# EAGLE design ArduinoBT (EAGLE 7.1.0)
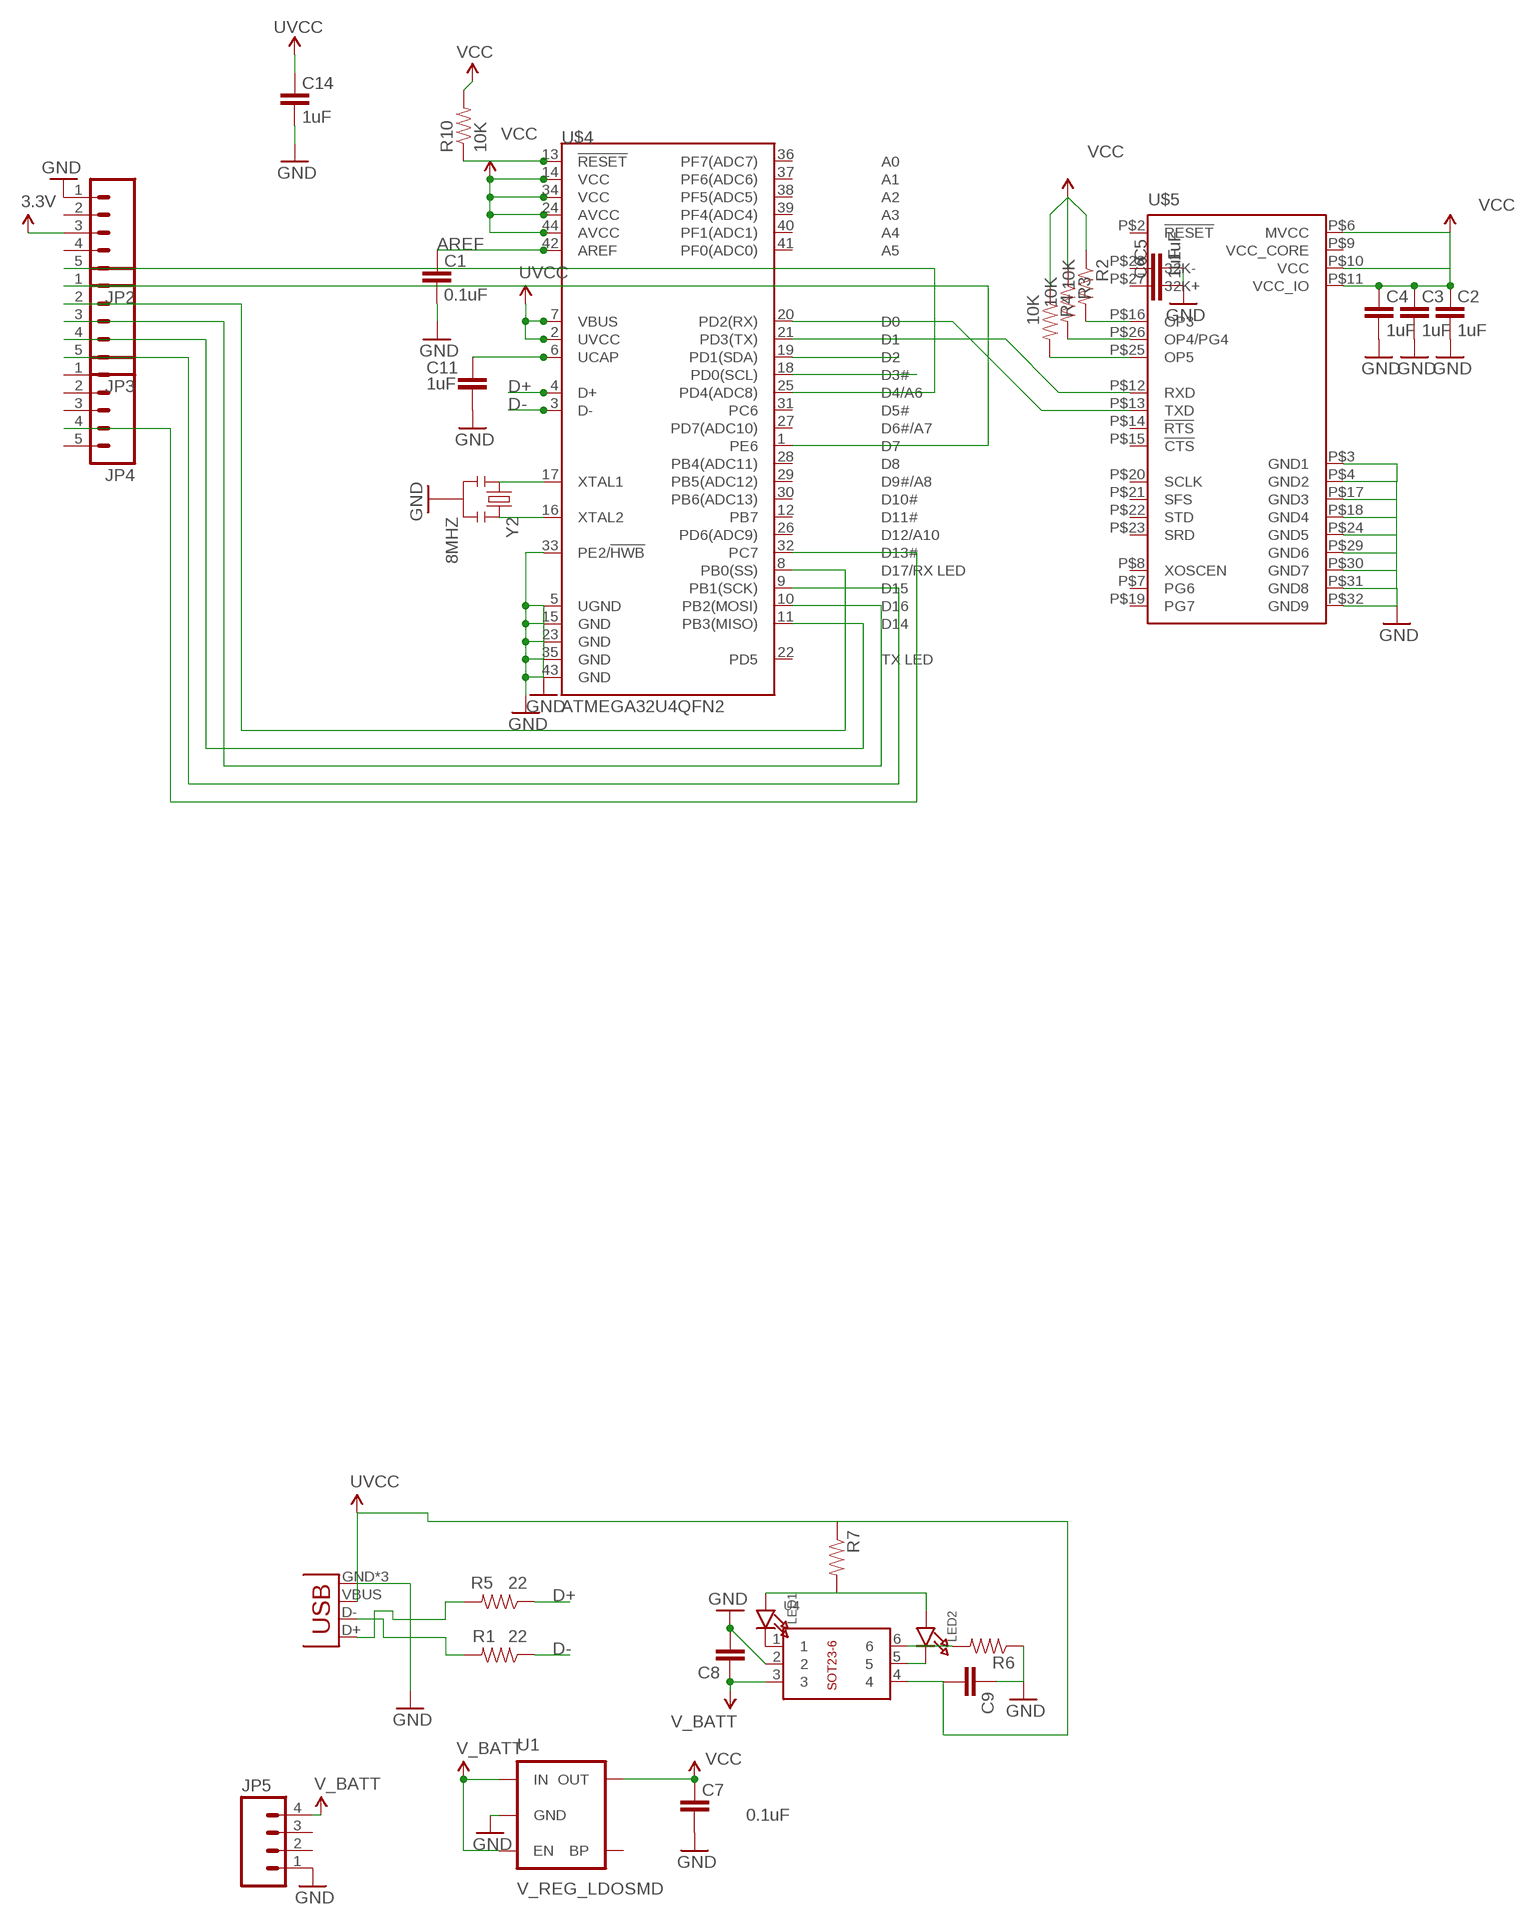
[diagram p0: schematic, sheet 1]

## Parts
C1  0.1uF  CAP0603-CAP  [0603-CAP]
C2  1uF  CAP0603-CAP  [0603-CAP]
C3  1uF  CAP0603-CAP  [0603-CAP]
C4  1uF  CAP0603-CAP  [0603-CAP]
C5  1uF  CAP0603-CAP  [0603-CAP]
C6  1uF  CAP0603-CAP  [0603-CAP]
C7  0.1uF  CAP0603-CAP  [0603-CAP]
C8  CAP0805  [0805]
C9  CAP0805  [0805]
C11  1uF  CAP0603-CAP  [0603-CAP]
C14  1uF  CAP0603-CAP  [0603-CAP]
JP1  USB-MICROB  [USB-MICROB]
JP2  M051.27MM  [1X05-1.27MM]
JP3  M051.27MM  [1X05-1.27MM]
JP4  M051.27MM  [1X05-1.27MM]
JP5  M041.27MM  [1X04-1.27MM]
LED1  LED0603_NOOUTLINE  [CHIPLED_0603_NOOUTLINE]
LED2  LED0603_NOOUTLINE  [CHIPLED_0603_NOOUTLINE]
R1  22  RESISTOR0603-RES  [0603-RES]
R2  10K  RESISTOR0603-RES  [0603-RES]
R3  10K  RESISTOR0603-RES  [0603-RES]
R4  10K  RESISTOR0603-RES  [0603-RES]
R5  22  RESISTOR0603-RES  [0603-RES]
R6  RESISTOR0805-RES  [0805]
R7  RESISTOR0805-RES  [0805]
R10  10K  RESISTOR0603-RES  [0603-RES]
U1  V_REG_LDOSMD  [SOT23-5]
U4  BREAKOUT_SOT23-6  [BREAKOUT_SOT23-6]
U$4  ATMEGA32U4QFN2  [SPARKFUN-DIGITALIC_QFN-44-NOPAD]
U$5  LMX9838  [LTCC70]
Y2  8MHZ  RESONATOR8MHZ  [RESONATOR-SMD]

## Nets
3.3V: C2.2 C3.2 C4.2 C7.2 JP2.3 R2.1 R3.1 R4.1 R10.2 U1.5(OUT) U$4.14(VCC) U$4.24(AVCC) U$4.34(VCC) U$4.44(AVCC) U$5.P$6(MVCC) U$5.P$10(VCC) U$5.P$11(VCC_IO) ; supply symbol labelled VCC
AREF: C1.2 U$4.42(AREF)
D+: R5.1 U$4.4(D+)
D-: R1.1 U$4.3(D-)
GND: C1.1 C2.1 C3.1 C4.1 C5.1 C6.1 C7.1 C8.2 C9.1 C11.1 C14.1 JP1.GND JP1.MT1(GND) JP1.MT2(GND) JP2.1 JP5.1 R6.1 U1.2(GND) U4.2 U$4.5(UGND) U$4.15(GND) U$4.23(GND) U$4.33(PE2/!HWB) U$4.35(GND) U$4.43(GND) U$5.P$3(GND1) U$5.P$4(GND2) U$5.P$17(GND3) U$5.P$18(GND4) U$5.P$24(GND5) U$5.P$29(GND6) U$5.P$30(GND7) U$5.P$31(GND8) U$5.P$32(GND9) Y2.2
N$1: R2.2 U$5.P$16(OP3)
N$2: R3.2 U$5.P$26(OP4/PG4)
N$3: C11.2 U$4.6(UCAP)
N$4: R4.2 U$5.P$25(OP5)
N$5: C5.2 U$5.P$28(32K-)
N$6: JP1.D- R1.2
N$7: JP1.D+ R5.2
N$8: C6.2 U$5.P$27(32K+)
N$9: U$4.16(XTAL2) Y2.3
N$10: R6.2 U4.6
N$11: JP2.5 U$4.25(PD4(ADC8))
N$12: JP3.1 U$4.1(PE6)
N$13: JP3.2 U$4.8(PB0(SS))
N$14: JP3.3 U$4.10(PB2(MOSI))
N$15: JP3.4 U$4.11(PB3(MISO))
N$16: JP3.5 U$4.9(PB1(SCK))
N$17: U$4.17(XTAL1) Y2.1
N$18: LED1.A LED2.A R7.2
N$20: JP4.4 U$4.32(PC7)
N$21: U$4.18(PD0(SCL))
N$25: R10.1 U$4.13(!RESET)
N$27: U$4.19(PD1(SDA))
N$28: U$4.20(PD2(RX)) U$5.P$13(TXD)
N$31: U$4.21(PD3(TX)) U$5.P$12(RXD)
N$32: LED1.C U4.1
N$33: LED2.C U4.5
UVCC: C9.2 C14.2 JP1.VBUS R7.1 U4.4 U$4.2(UVCC) U$4.7(VBUS)
V_BATT: C8.1 JP5.4 U1.1(IN) U1.3(EN) U4.3
Unconnected: JP2.2 JP2.4 JP4.1 JP4.2 JP4.3 JP4.5 JP5.2 JP5.3 U1.4(BP) U$4.12(PB7) U$4.22(PD5) U$4.26(PD6(ADC9)) U$4.27(PD7(ADC10)) U$4.28(PB4(ADC11)) U$4.29(PB5(ADC12)) U$4.30(PB6(ADC13)) U$4.31(PC6) U$4.36(PF7(ADC7)) U$4.37(PF6(ADC6)) U$4.38(PF5(ADC5)) U$4.39(PF4(ADC4)) U$4.40(PF1(ADC1)) U$4.41(PF0(ADC0)) U$5.P$2(!RESET) U$5.P$7(PG6) U$5.P$8(XOSCEN) U$5.P$14(!RTS) U$5.P$15(!CTS) U$5.P$19(PG7) U$5.P$20(SCLK) U$5.P$21(SFS) U$5.P$22(STD) U$5.P$23(SRD)

## Power pins joined to a net without a drawn wire
VCC_CORE: U$5.P$9(VCC_CORE)

## Library data of the parts
C1-C7 C11 C14 = SparkFun:CAP: Capacitor Standard 0603 ceramic capacitor, and 0.1" leaded capacitor.
C8 C9 = SparkFun-Capacitors:CAP: Capacitor Standard 0603 ceramic capacitor, and 0.1" leaded capacitor.
JP1 = SparkFun-Connectors:USB: USB Connectors USB-B-PTH is fully proven SKU : PRT-00139/CONN-08278 USB-miniB is fully proven SKU : PRT-00587 USB-A-PCB is untested. USB-A-H is throughly reviewed, but untested. Spark Fun Electronics SKU : PRT-00437 USB-B-SMT is throughly reviewed, but untested. Needs silkscreen touching up. USB-A-S has not been used/tested USB-MB-H has not been used/tested USB-MICROB has been used. CONN-09505; PROD_ID: CONN-09505
JP2-JP4 = SparkFun-Connectors:M05: Header 5 Standard 5-pin 0.1" header. Use with straight break away headers (SKU : PRT-00116), right angle break away headers (PRT-00553), swiss pins (PRT-00743), machine pins (PRT-00117), and female headers (PRT-00115). Molex polarized connector foot print use with SKU : PRT-08230 with associated crimp pins and housings.
JP5 = SparkFun-Connectors:M04: Header 4 Standard 4-pin 0.1" header. Use with straight break away headers (SKU : PRT-00116), right angle break away headers (PRT-00553), swiss pins (PRT-00743), machine pins (PRT-00117), and female headers (PRT-00115). Molex polarized connector foot print use with SKU : PRT-08231 with associated crimp pins and housings. 1MM SMD Version SKU: PRT-10208
LED1 LED2 = microbuilder:LED: LED 0603 - 0603 Surface Mount Package 2mA: Green LED - Low Power (3.9mcd, 2ma, 1.7Vf) - Digikey: 475-2709-2-ND Orange LED - Low Power (9.8mcd, 2ma, 1.8Vf) - Digikey: 475-1194-2-ND Red LED - Low Power (5mcd, 2ma, 1.8Vf) - Digikey: 475-1195-2-ND Yellow LED - Low Power (7mcd, 2ma, 1.8Vf) - Digikey: 475-1196-2-ND 5mA: Blue LED - Low Power (17mcd, 5ma, 2.9Vf) - Digikey: LNJ937W8CRACT-ND 0805 - 0805 Surface Mount Package 2mA: Red LED (8.8mcd, 2mA, 1.8Vf, Clear) - Low Power [Digikey: 475-2510-1-ND] Green LED (5mcd, 2mA, 1.8Vf, Clear) - Low Power [Digikey: 475-2730-1-ND] Yellow LED (11.3mcd, 2mA, 1.8Vf, Clear) - Low Power [Digikey: 475-2555-1-ND] 20mA: Red LED (104mcd, 20mA, Diffused) - LS R976 [Digikey: 475-1278-6-ND] Red LED (12mcd, 20mA, 2.0Vf, Clear) - APT2012EC [Digikey: 754-1128-1-ND] Green LED (15mcd, 20mA, 2.2Vf, Clear) - APT2012GC [Digikey: 754-1131-1-ND] Orange LED (160mcd, 20mA, 2.1Vf, Clear) - APT2012SECK [Digikey: 754-1130-1-ND] 1206 - 1206 Surface Mount Package Green LED (26mcd, 20mA, Diffused) - LG N971 [Digikey: 475-1407-6-ND] Red LED (15mcd, 20mA, Diffused) - LH N974 [Digikey: 475-1416-6-ND]
R1-R5 R10 = SparkFun:RESISTOR: Resistor Basic schematic elements and footprints for 0603, 1206, and PTH resistors.
R6 R7 = SparkFun-Resistors:RESISTOR: Resistor Basic schematic elements and footprints for 0603, 1206, and PTH resistors.
U1 = SparkFun-PowerIC:V_REG_LDO: Voltage Regulator LDO Standard 150mA LDO voltage regulator in SOT-23 layout. Micrel part MIC5205. BP (by-pass) pin is used to lower output noise with 470pF cap.
U4 = microbuilder:BREAKOUT_SOT23-6: IC Breakout SOT23-6
U$4 = SparkFun-DigitalIC:ATMEGA32U4: Atmel 44-pin 8-bit Microcontroller with 32KBytes of ISP Flash and USB Controller ----- Please use the QFN-44-NOPAD_1:1 package for the footprint of all boards using a 32U4. Route traces directly away from the pads as much as possible.
U$5 = ns_lmx9838:LMX9838: Bluetooth Serial Port Module Manufacturer: National Semiconductor Source: http://www.national.com/mpf/LM/LMX9838.html
Y2 = SparkFun-FreqCtrl:RESONATOR: Resonator Small SMD resonator. Used, eg, on the Arduino Pro/ Pro Mini boards. 8MHz- XTAL-08895 16MHz- XTAL-08900; PROD_ID: XTAL-08895

## Net classes
0 default: width 0.178 mm

## Board
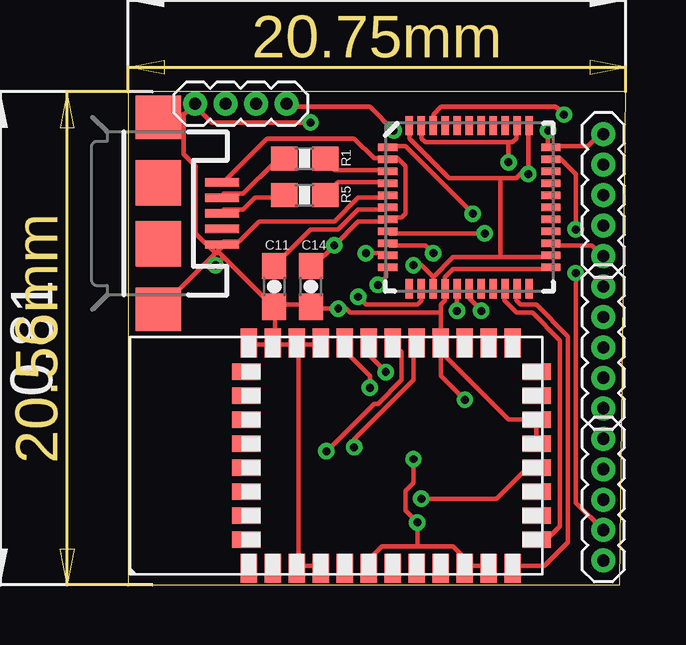
[diagram p1: board, top side]
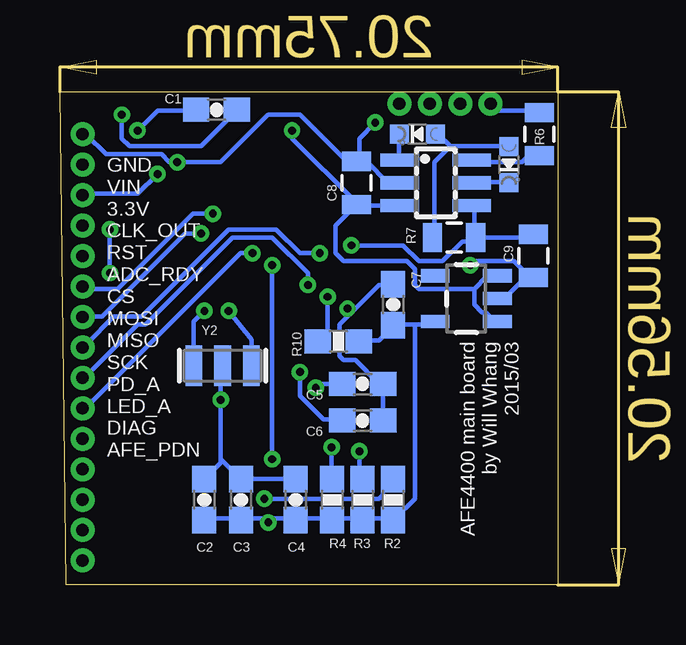
[diagram p2: board, bottom side, seen from below]

Size 20.75 x 20.56 mm. Coordinates in mm from the lower left corner, seen from the top.
Outline: 0,0 20.5,0 20.75,20.56 0,20.56 0,0
Copper layers (1*16): Top 0.0356mm / dielectric 1.5011mm / Bottom 0.0356mm
Design rules "LaenPCBOrder *": minimum track width 6mil, minimum drill 13mil, track to track 6mil, track to pad 6mil, pad to pad 6mil, via to via 6mil, smd to smd 6mil, copper to edge 15mil, drill to drill 6mil, minimum pad ring 7mil, minimum via ring 7mil, stop-mask expansion 3mil, vias tented up to drill 14mil, thermal gap 10mil

### Footprints (pad centres in the part's own frame; a part is rotated, then mirrored left to right if it is on the bottom)
0603-CAP = smd 1.1 x 1: 1 -0.85,0; 2 0.85,0
0805 = smd 0.8 x 1.2: 1 -0.9,0; 2 0.9,0
USB-MICROB = smd 0.35 x 1.4: D+ 0,2.65; D- -0.65,2.65; GND 1.3,2.65; ID 0.65,2.65; VBUS -1.3,2.65 | smd 1.8 x 1.9: MT1 -4,0; MT2 4,0 | smd 1.9 x 1.9: P$1 -1.27,0; P$2 1.27,0
1X05-1.27MM = drill 0.508 pad 1: 1 0,0; 2 1.27,0; 3 2.54,0; 4 3.81,0; 5 5.08,0
1X04-1.27MM = drill 0.508 pad 1: 1 0,0; 2 1.27,0; 3 2.54,0; 4 3.81,0
CHIPLED_0603_NOOUTLINE = smd 0.8 x 0.8: A 0,-0.75; C 0,0.75
0603-RES = smd 1.1 x 1: 1 -0.85,0; 2 0.85,0
SOT23-5 = smd 0.55 x 1.2: 1 -0.95,-1.3; 2 0,-1.3; 3 0.95,-1.3; 4 0.95,1.3; 5 -0.95,1.3
BREAKOUT_SOT23-6 = smd 0.55 x 1.6: 1 -0.95,-1.5; 2 0,-1.5; 3 0.95,-1.5; 4 0.95,1.5; 5 0,1.5; 6 -0.95,1.5
SPARKFUN-DIGITALIC_QFN-44-NOPAD = smd 0.8 x 0.3: 1 -3.4,2.5; 2 -3.4,2; 3 -3.4,1.5; 4 -3.4,1; 5 -3.4,0.5; 6 -3.4,0; 7 -3.4,-0.5; 8 -3.4,-1; 9 -3.4,-1.5; 10 -3.4,-2; 11 -3.4,-2.5; 23 3.4,-2.5; 24 3.4,-2; 25 3.4,-1.5; 26 3.4,-1; 27 3.4,-0.5; 28 3.4,0; 29 3.4,0.5; 30 3.4,1; 31 3.4,1.5; 32 3.4,2; 33 3.4,2.5 | smd 0.3 x 0.8: 12 -2.5,-3.4; 13 -2,-3.4; 14 -1.5,-3.4; 15 -1,-3.4; 16 -0.5,-3.4; 17 0,-3.4; 18 0.5,-3.4; 19 1,-3.4; 20 1.5,-3.4; 21 2,-3.4; 22 2.5,-3.4; 34 2.5,3.4; 35 2,3.4; 36 1.5,3.4; 37 1,3.4; 38 0.5,3.4; 39 0,3.4; 40 -0.5,3.4; 41 -1,3.4; 42 -1.5,3.4; 43 -2,3.4; 44 -2.5,3.4
LTCC70 = smd 1.2 x 0.7: P$1 -8.2,13; P$2 -8.2,12; P$3 -8.2,11; P$4 -8.2,10; P$5 -8.2,9; P$6 -8.2,8; P$7 -8.2,7; P$8 -8.2,6; P$9 -8.2,5; P$10 -8.2,4; P$11 -8.2,3; P$12 -8.2,2; P$21 1.2,2; P$22 1.2,3; P$23 1.2,4; P$24 1.2,5; P$25 1.2,6; P$26 1.2,7; P$27 1.2,8; P$28 1.2,9; P$29 1.2,10; P$30 1.2,11; P$31 1.2,12; P$32 1.2,13 | smd 0.7 x 1.2: P$13 -7,1; P$14 -6,1; P$15 -5,1; P$16 -4,1; P$17 -3,1; P$18 -2,1; P$19 -1,1; P$20 0,1; P$33 0,13.1; P$34 -1,13.1; P$35 -2,13.1; P$36 -3,13.1; P$37 -4,13.1; P$38 -5,13.1; P$39 -6,13.1; P$40 -7,13.1
RESONATOR-SMD = smd 0.7 x 1.7: 1 -1.2,0; 2 0,0; 3 1.2,0

### Placement (x,y rotation side)
C1  14.22,19.81 0 bottom
C2  14.73,3.56 270 bottom
C3  13.21,3.56 270 bottom
C4  10.92,3.56 270 bottom
C5  8.13,8.38 180 bottom
C6  8.13,6.86 180 bottom
C7  6.86,11.68 270 bottom
C8  8.38,16.76 90 bottom
C9  1.02,13.72 90 bottom
C11  6.1,12.45 90 top
C14  7.62,12.45 90 top
JP1  1.27,15.49 270 top
JP2  19.81,18.8 270 top
JP3  19.81,12.45 270 top
JP4  19.81,6.1 270 top
JP5  2.79,20.07 0 top
LED1  5.84,18.8 90 bottom
LED2  2.03,17.53 180 bottom
R1  7.37,17.78 180 top
R2  6.86,3.56 90 bottom
R3  8.13,3.56 90 bottom
R4  9.4,3.56 90 bottom
R5  7.37,16.26 180 top
R6  0.76,18.8 270 bottom
R7  4.32,14.48 180 bottom
R10  9.14,10.16 0 bottom
U1  3.81,11.94 90 bottom
U4  5.08,16.76 270 bottom
U$4  14.22,15.75 0 top
U$5  18.03,8.89 90 top
Y2  13.97,9.14 0 bottom

### Tracks (layer width: path | path; a pad name or v marks a point on that pad's centre or on a via)
3.3V  (via drill 0.33)
  Top 0.178: 12.73,12.84 12.73,12.51 U$4.14 | 12.73,12.84 13.55,13.66 15.53,13.66 | 15.53,13.66 17.51,13.66 U$4.24 | 15.53,16.97 16.19,16.97 16.52,17.3 | 15.53,16.97 13.39,16.97 11.73,18.62 11.73,19.11 U$4.44 | 16.52,17.3 16.69,17.46 16.69,19.11 U$4.34 | 16.52,17.3 v16.69,17.13 | 15.53,16.97 15.53,13.66 | 12.06,1.61 13.55,1.61 13.88,1.28 13.88,0.79 U$5.P$10 14.05,0.79 14.87,0.79 U$5.P$11 | 12.06,1.61 10.58,1.61 10.08,1.12 10.08,0.79 U$5.P$6 | 12.06,1.61 v12.06,2.6 11.57,3.1 11.57,3.92 11.9,4.25 v11.9,5.25 | 12.73,12.84 12.23,13.34 v11.9,13.34
  Bottom 0.178: v16.69,17.13 17.51,16.31 19.66,16.31 JP2.3 | 5.96,10.86 5.13,10.86 U1.5 | 5.96,10.86 6.78,10.86 C7.2 6.95,10.69 7.44,10.2 8.27,10.2 R10.2 | C2.2 14.71,2.77 13.22,2.77 C3.2 13.06,2.77 12.06,2.77 | 12.06,2.77 11.07,2.77 C4.2 10.91,2.77 9.42,2.77 R4.1 9.26,2.77 8.27,2.77 R3.1 8.1,2.77 6.95,2.77 R2.1 6.78,2.77 5.96,3.59 5.96,10.86 | 12.06,2.77 v12.06,2.6 | v11.9,5.25 v11.9,13.34
AREF  (via drill 0.33)
  Top 0.178: v18.17,19.61 17.84,19.94 13.06,19.94 12.73,19.61 12.73,19.28 U$4.42
  Bottom 0.178: v18.17,19.61 18.17,18.62 17.84,18.29 14.87,18.29 13.39,19.77 C1.2
D+
  Top 0.178: U$4.4 10.74,16.8 8.76,16.8 8.27,16.31 R5.1
D-
  Top 0.178: U$4.3 10.74,17.3 8.6,17.3 8.27,17.63 R1.1
GND  (via drill 0.33)
  Top 0.178: U$5.P$17 17.02,5.91 17.02,6.73 U$5.P$18 17.02,6.9 15.86,6.9 13.06,9.7 | U$4.23 17.51,13.17 13.55,13.17 13.22,12.84 13.22,12.51 U$4.15 13.22,11.85 13.06,11.68 13.06,11.35 | C11.1 6.12,11.52 6.12,10.2 U$5.P$31 | C11.1 6.12,11.68 7.61,11.68 C14.1 7.77,11.52 v8.76,11.52 9.09,11.52 9.26,11.35 13.06,11.35 | U$5.P$32 5.13,10.03 5.96,10.03 U$5.P$31 | U$5.P$31 6.12,10.03 6.95,10.03 U$5.P$30 7.11,10.03 | 15.86,18.45 16.03,18.45 16.19,18.62 16.19,19.11 U$4.35 | 15.86,18.45 12.39,18.45 12.23,18.62 12.23,19.11 U$4.43 | JP2.1 19.66,18.78 19.16,18.29 17.68,18.29 U$4.33 17.51,18.29 v17.51,18.95 | v15.86,17.63 15.86,18.45 | 2.32,19.61 1.33,19.61 JP1.MT1 | 2.32,19.61 2.65,19.94 JP5.1 2.82,19.94 3.48,19.28 v7.61,19.28 | U$4.5 10.74,16.14 9.59,16.14 8.6,15.15 5.46,15.15 4.63,14.33 3.97,14.33 JP1.GND 3.97,14.16 3.64,13.83 | 3.64,13.83 1.33,11.52 JP1.MT2 | 2.32,19.61 2.32,17.96 2.82,17.46 2.82,14.66 3.64,13.83 | 3.97,13.66 3.81,13.83 3.64,13.83 | 3.97,13.66 5.96,11.68 C11.1 | 7.11,0.79 7.94,0.79 U$5.P$4 | 7.11,10.03 7.94,10.03 U$5.P$29 | 13.06,11.35 13.06,10.2 U$5.P$24 | 7.11,10.03 7.11,0.79 | 7.11,0.79 U$5.P$3 | 13.06,9.7 13.06,10.03 U$5.P$24 | 3.97,13.66 v3.64,13.34 | 13.06,9.7 13.06,8.71 v14.05,7.72 | 13.06,9.7 U$5.P$24
  Bottom 0.178: C4.1 11.07,4.42 13.06,4.42 C3.1 13.22,4.42 14.05,5.25 | C6.1 7.28,6.9 C5.1 7.44,8.38 8.43,9.37 8.93,9.37 9.09,9.54 9.09,10.86 8.6,11.35 | C8.2 8.27,17.63 7.94,17.63 7.11,16.8 6.62,16.8 U4.2 | v17.51,18.95 16.69,19.77 15.2,19.77 C1.1 | JP2.1 19.66,18.78 18.83,17.96 16.52,17.96 16.19,17.63 v15.86,17.63 14.05,17.63 12.06,19.61 10.74,19.61 8.93,17.79 8.43,17.79 C8.2 | R6.1 0.84,19.77 2.49,19.77 2.65,19.94 JP5.1 | v7.61,19.28 8.27,18.62 8.27,17.79 C8.2 | 8.6,11.35 7.44,12.51 6.95,12.51 C7.1 | 14.05,5.25 14.05,5.08 14.71,4.42 C2.1 | 14.05,5.25 v14.05,7.72 14.05,9.04 Y2.2 | v8.76,11.52 8.6,11.35 | U1.2 2.49,12.01 2.16,12.01 1.5,12.68 1.17,12.68 C9.1 1.17,12.84 1.83,13.5 3.48,13.5 v3.64,13.34
  pour Top (isolate 0.305): -0.76,-11.94 31.75,-11.68 29.46,-7.37 -3.05,-7.62
  pour Bottom (isolate 0.305): -4.83,-15.75 29.21,-14.22 29.72,-6.6 -4.32,-8.13
N$1  (via drill 0.33)
  Top 0.178: v12.23,3.59 15.37,3.59 16.52,4.75 17.02,4.75 U$5.P$16
  Bottom 0.178: v12.23,3.59 7.44,3.59 7.28,3.76 7.28,3.92 6.95,4.25 R2.2
N$2  (via drill 0.33)
  Top 0.178: v8.27,5.57 10.25,7.56 10.41,7.56 11.41,8.55 11.41,9.7 11.07,10.03 U$5.P$26
  Bottom 0.178: v8.27,5.57 8.27,4.42 R3.2
N$3
  Top 0.178: U$4.6 10.74,15.65 9.59,15.65 8.76,14.82 7.61,14.82 6.12,13.34 C11.2
N$4  (via drill 0.33)
  Top 0.178: v9.42,5.74 9.42,6.07 11.9,8.55 11.9,10.03 U$5.P$25
  Bottom 0.178: v9.42,5.74 9.42,4.42 R4.2
N$5  (via drill 0.33)
  Top 0.178: v10.08,8.22 10.08,8.71 9.09,9.7 9.09,10.03 U$5.P$28
  Bottom 0.178: C5.2 9.92,8.38 v10.08,8.22
N$6
  Top 0.178: R1.2 6.45,17.63 6.12,17.63 4.8,16.31 3.97,16.31 JP1.D-
N$7
  Top 0.178: R5.2 6.45,16.14 5.3,16.14 4.8,15.65 3.97,15.65 JP1.D+
N$8  (via drill 0.33)
  Top 0.178: v10.74,8.88 10.08,9.54 10.08,10.03 U$5.P$27
  Bottom 0.178: v10.74,8.88 10.74,7.89 9.75,6.9 9.09,6.9 C6.2
N$9  (via drill 0.33)
  Top 0.178: v13.72,11.43 U$4.16
  Bottom 0.178: Y2.3 12.77,10.23 v13.72,11.43
N$10
  Bottom 0.178: R6.2 0.84,17.79 1.33,17.79 1.5,17.63 3.48,17.63 U4.6
N$11
  Top 0.178: U$4.25 17.68,14.16 19.33,14.16 19.66,13.83 JP2.5
N$12  (via drill 0.33)
  Top 0.178: v14.38,15.48 11.57,18.29 10.91,18.29 U$4.1
  Bottom 0.178: v14.38,15.48 15.2,15.48 18.34,12.34 19.66,12.34 JP3.1
N$13  (via drill 0.33)
  Top 0.178: v14.87,14.66 10.91,14.66 U$4.8
  Bottom 0.178: v14.87,14.66 15.53,14.66 19,11.19 19.66,11.19 JP3.2
N$14  (via drill 0.33)
  Top 0.178: v9.92,13.83 10.74,13.83 U$4.10
  Bottom 0.178: v9.92,13.83 10.74,13.83 11.73,14.82 13.72,14.82 17.35,11.19 18.5,11.19 19.66,10.03 JP3.3
N$15  (via drill 0.33)
  Top 0.178: v10.41,12.51 10.74,12.84 10.74,13.17 U$4.11
  Bottom 0.178: v10.41,12.51 10.41,13 11.9,14.49 13.55,14.49 17.18,10.86 17.51,10.86 19.66,8.71 JP3.4
N$16  (via drill 0.33)
  Top 0.178: v12.73,13.83 12.39,14.16 10.91,14.16 U$4.9
  Bottom 0.178: v12.73,13.83 13.22,13.83 19.66,7.39 JP3.5
N$17  (via drill 0.33)
  Top 0.178: v14.73,11.43 14.22,11.94 U$4.17
  Bottom 0.178: Y2.1 15.17,10.99 v14.73,11.43
N$18
  Bottom 0.178: 4.47,18.29 2.16,18.29 LED2.A | 4.47,18.29 4.97,18.78 LED1.A | 4.47,18.29 5.13,17.63 5.13,14.49 R7.2
N$20  (via drill 0.33)
  Top 0.178: v18.67,14.82 18.67,17.13 18.01,17.79 17.68,17.79 U$4.32 | v18.67,13 18.67,3.43 JP4.4
  Bottom 0.178: v18.67,13 v18.67,14.82
N$25  (via drill 0.33)
  Top 0.178: v9.59,12.01 9.92,11.68 12.06,11.68 12.23,11.85 U$4.13
  Bottom 0.178: v9.59,12.01 9.59,10.53 9.92,10.2 R10.1
N$28
  Top 0.178: U$4.20 15.7,12.34 15.7,11.85 16.19,11.35 16.85,11.35 18.01,10.2 18.01,2.44 17.51,1.94 17.18,1.94 U$5.P$13
N$31
  Top 0.178: U$4.21 16.19,12.34 16.19,11.85 16.36,11.68 17.02,11.68 18.34,10.36 18.34,1.78 17.35,0.79 16.19,0.79 U$5.P$12
N$32
  Bottom 0.178: LED1.C 6.62,18.78 6.62,17.79 U4.1
N$33
  Bottom 0.178: LED2.C 2.16,16.8 3.48,16.8 U4.5
UVCC  (via drill 0.33)
  Top 0.178: C14.2 7.77,13.34 v8.6,14.16 9.59,15.15 10.74,15.15 U$4.7 10.91,15.32 11.41,15.32 11.57,15.48 11.57,17.46 11.24,17.79 10.91,17.79 U$4.2 10.74,17.79 10.25,17.79 9.42,18.62 5.79,18.62 3.97,16.8 JP1.VBUS
  Bottom 0.178: R7.1 3.48,14.49 3.48,15.81 U4.4 | C9.2 1.17,14.49 3.31,14.49 R7.1 | v8.6,14.16 6.45,14.16 5.79,13.5 4.8,13.5 3.97,14.33 3.48,14.33 R7.1
V_BATT  (via drill 0.33)
  Top 0.178: v11.07,18.95 10.08,19.94 6.62,19.94 JP5.4
  Bottom 0.178: 3.48,12.34 3.48,11.68 3.15,11.35 2.98,11.35 2.65,11.02 U1.1 | 3.48,12.34 2.98,12.84 2.65,12.84 U1.3 | C8.1 8.27,15.81 6.62,15.81 U4.3 | 3.48,12.34 5.79,12.34 5.96,12.51 5.96,13.17 6.29,13.5 8.93,13.5 9.26,13.83 9.26,14.99 8.43,15.81 C8.1 | v11.07,18.95 11.07,18.62 8.43,15.98 C8.1

### Text on the board
bNames: AFE4400 main board / by Will Whang / 2015/03 | GND / VIN / 3.3V / CLK_OUT / RST / ADC_RDY / CS / MOSI / MISO / SCK / PD_A / LED_A / DIAG / AFE_PDN